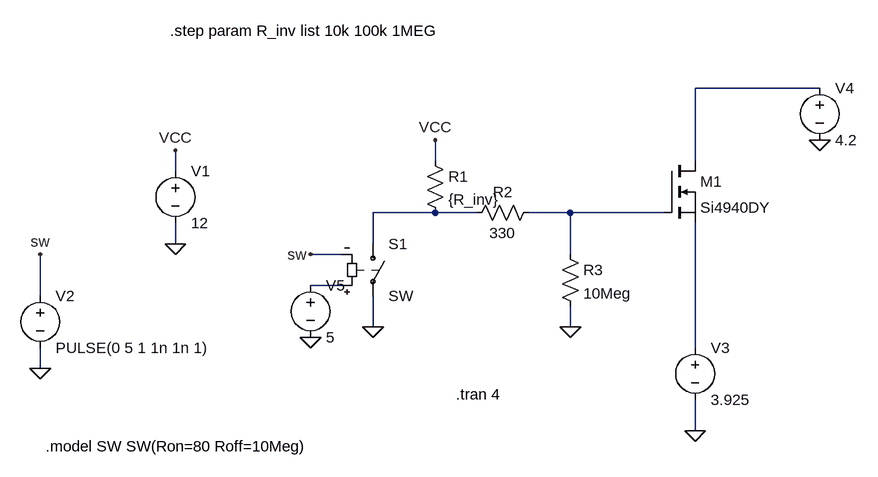
[diagram p0: schematic Pullup Optokoppler leistungs seite.asc]
Pullup Optokoppler leistungs seite.asc, the LTspice schematic file:
Version 4.1
SHEET 1 1120 680
WIRE 1056 -16 864 -16
WIRE 464 96 464 64
WIRE 864 96 864 -16
WIRE 64 112 64 80
WIRE 464 176 368 176
WIRE 528 176 464 176
WIRE 672 176 608 176
WIRE 816 176 672 176
WIRE 64 224 64 192
WIRE 368 224 368 176
WIRE 320 240 272 240
WIRE 672 240 672 176
WIRE 320 288 272 288
WIRE -144 304 -144 240
WIRE 368 352 368 304
WIRE 672 352 672 320
WIRE 864 384 864 192
WIRE -144 416 -144 384
WIRE 864 512 864 464
FLAG 64 224 0
FLAG 64 80 VCC
FLAG -144 416 0
FLAG -144 240 sw
FLAG 464 64 VCC
FLAG 368 352 0
FLAG 272 368 0
FLAG 272 240 sw
FLAG 672 352 0
FLAG 1056 64 0
FLAG 864 512 0
SYMBOL voltage 64 96 R0
SYMATTR InstName V1
SYMATTR Value 12
SYMBOL sw 368 208 R0
SYMATTR InstName S1
SYMBOL voltage -144 288 R0
WINDOW 123 0 0 Left 0
WINDOW 39 0 0 Left 0
SYMATTR InstName V2
SYMATTR Value PULSE(0 5 1 1n 1n 1)
SYMBOL res 448 80 R0
SYMATTR InstName R1
SYMATTR Value {R_inv}
SYMBOL res 624 160 R90
WINDOW 0 0 56 VBottom 2
WINDOW 3 32 56 VTop 2
SYMATTR InstName R2
SYMATTR Value 330
SYMBOL res 656 224 R0
SYMATTR InstName R3
SYMATTR Value 10Meg
SYMBOL nmos 816 96 R0
SYMATTR InstName M1
SYMATTR Value Si4940DY
SYMBOL voltage 864 368 R0
SYMATTR InstName V3
SYMATTR Value 3.925
SYMBOL voltage 1056 -32 R0
SYMATTR InstName V4
SYMATTR Value 4.2
SYMBOL voltage 272 272 R0
WINDOW 123 0 0 Left 0
WINDOW 39 0 0 Left 0
SYMATTR InstName V5
SYMATTR Value 5
TEXT 496 456 Left 2 !.tran 4
TEXT -136 536 Left 2 !.model SW SW(Ron=80 Roff=10Meg)
TEXT 56 -104 Left 2 !.step param R_inv list 10k 100k 1MEG

The netlist it stands for:
* Pullup Optokoppler leistungs seite.asc
V1 VCC 0 12
S1 N002 0 N004 sw SW
V2 sw 0 PULSE(0 5 1 1n 1n 1)
R1 VCC N002 {R_inv}
R2 N003 N002 330
R3 N003 0 10Meg
M1 N001 N003 N005 N005 Si4940DY
V3 N005 0 3.925
V4 N001 0 4.2
V5 N004 0 5
.model NMOS NMOS
.model PMOS PMOS
.lib standard.mos
.tran 4
.model SW SW(Ron=80 Roff=10Meg)
.step param R_inv list 10k 100k 1MEG
.backanno
.end